# EAGLE design rld-node (EAGLE 9.6.2)

## Sheet 1 of 3
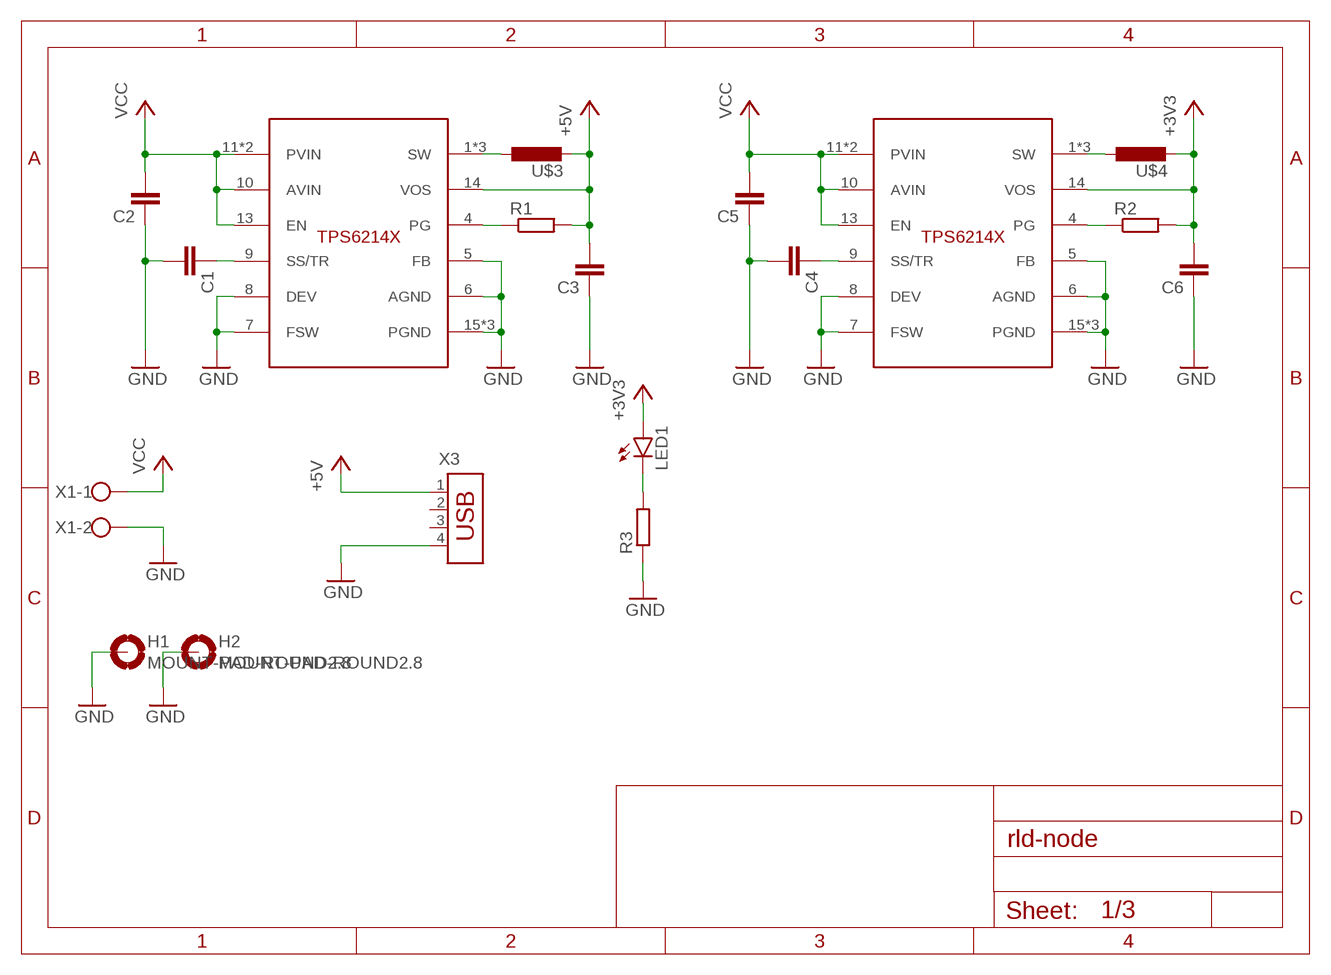
[diagram p0: schematic, sheet 1]

### Parts
C1  C-EUC0805  [C0805]
C2  C-EUC0805  [C0805]
C3  C-EUC0805  [C0805]
C4  C-EUC0805  [C0805]
C5  C-EUC0805  [C0805]
C6  C-EUC0805  [C0805]
H1  MOUNT-PAD-ROUND2.8  [2,8-PAD]
H2  MOUNT-PAD-ROUND2.8  [2,8-PAD]
L1  TPS6214X  [VQFN16-3X3]
L2  TPS6214X  [VQFN16-3X3]
LED1  LEDSML0805  [SML0805]
R1  R-EU_R0805  [R0805]
R2  R-EU_R0805  [R0805]
R3  R-EU_R0805  [R0805]
U$3  IHLP-1212  [1212BZ]
U$4  IHLP-1212  [1212BZ]
X1  W237-102  [W237-102]
X3  USB-787616  [USB]

### Nets
+3V3: C6.2 L2.14(VOS) LED1.A R2.2 U$4.2 ; also sheet 2,3
+5V: C3.2 L1.14(VOS) R1.2 U$3.2 X3.1
GND: C1.2 C2.1 C3.1 C4.2 C5.1 C6.1 H1.B2,8(MOUNT) H2.B2,8(MOUNT) L1.5(FB) L1.6(AGND) L1.7(FSW) L1.8(DEV) L1.15(PGND) L1.16(PGND) L1.17(PGND) L2.5(FB) L2.6(AGND) L2.7(FSW) L2.8(DEV) L2.15(PGND) L2.16(PGND) L2.17(PGND) R3.1 X1.2 X3.4 ; also sheet 2,3
N$1: C1.1 L1.9(SS/TR)
N$2: C4.1 L2.9(SS/TR)
N$3: L2.4(PG) R2.1
N$4: L1.4(PG) R1.1
N$5: L1.1(SW) L1.2(SW) L1.3(SW) U$3.1
N$6: L2.1(SW) L2.2(SW) L2.3(SW) U$4.1
N$7: LED1.C R3.2
VCC: C2.2 C5.2 L1.10(AVIN) L1.11(PVIN) L1.12(PVIN) L1.13(EN) L2.10(AVIN) L2.11(PVIN) L2.12(PVIN) L2.13(EN) X1.1
Unconnected: X3.2 X3.3

## Sheet 2 of 3
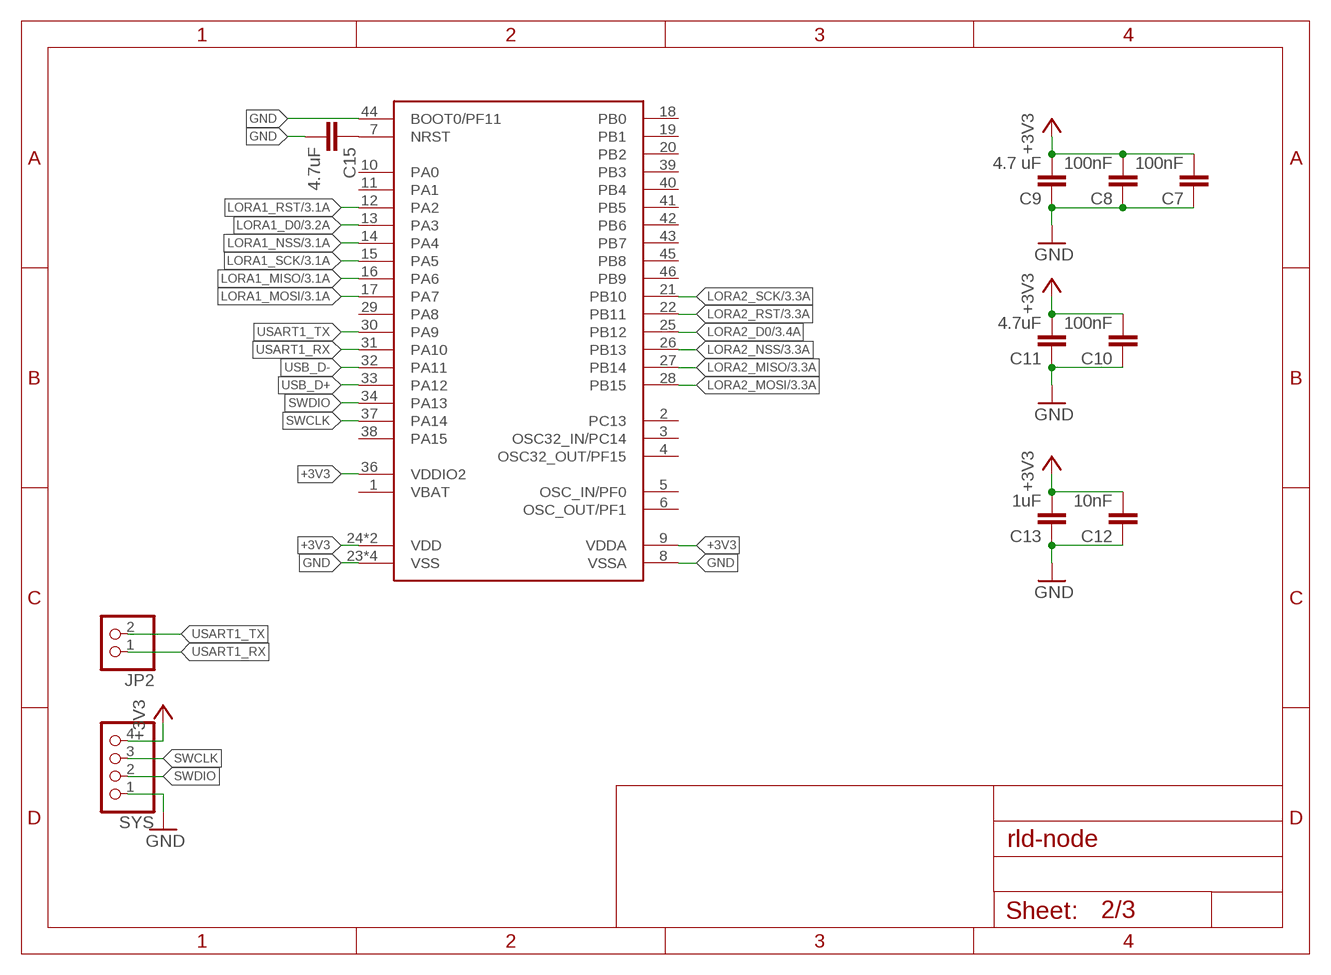
[diagram p1: schematic, sheet 2]

### Parts
C7  100nF  C-EUC0805  [C0805]
C8  100nF  C-EUC0805  [C0805]
C9  4.7 uF  C-EUC0805  [C0805]
C10  100nF  C-EUC0805  [C0805]
C11  4.7uF  C-EUC0805  [C0805]
C12  10nF  C-EUC0805  [C0805]
C13  1uF  C-EUC0805  [C0805]
C15  4.7uF  C-EUC0805  [C0805]
JP2  PINHD-1X2  [1X02]
SYS  PINHD-1X4  [1X04]
U$5  STM32-F042X4/6-48  [UFQFPN48-7X7]

### Nets
+3V3: C7.2 C8.2 C9.2 C10.2 C11.2 C12.2 C13.2 SYS.4 U$5.9(VDDA) U$5.24(VDD) U$5.36(VDDIO2) U$5.48(VDD) ; also sheet 1,3
GND: C7.1 C8.1 C9.1 C10.1 C11.1 C12.1 C13.1 C15.2 SYS.1 U$5.8(VSSA) U$5.23(VSS) U$5.35(VSS) U$5.44(BOOT0/PF11) U$5.47(VSS) U$5.49(VSS) ; also sheet 1,3
LORA1_D0: U$5.13(PA3) ; also sheet 3
LORA1_MISO: U$5.16(PA6) ; also sheet 3
LORA1_MOSI: U$5.17(PA7) ; also sheet 3
LORA1_NSS: U$5.14(PA4) ; also sheet 3
LORA1_RST: U$5.12(PA2) ; also sheet 3
LORA1_SCK: U$5.15(PA5) ; also sheet 3
LORA2_D0: U$5.25(PB12) ; also sheet 3
LORA2_MISO: U$5.27(PB14) ; also sheet 3
LORA2_MOSI: U$5.28(PB15) ; also sheet 3
LORA2_NSS: U$5.26(PB13) ; also sheet 3
LORA2_RST: U$5.22(PB11) ; also sheet 3
LORA2_SCK: U$5.21(PB10) ; also sheet 3
N$8: C15.1 U$5.7(NRST)
SWCLK: SYS.3 U$5.37(PA14)
SWDIO: SYS.2 U$5.34(PA13)
USART1_RX: JP2.1 U$5.31(PA10)
USART1_TX: JP2.2 U$5.30(PA9)
USB_D+: U$5.33(PA12)
USB_D-: U$5.32(PA11)
Unconnected: U$5.1(VBAT) U$5.2(PC13) U$5.3(OSC32_IN/PC14) U$5.4(OSC32_OUT/PF15) U$5.5(OSC_IN/PF0) U$5.6(OSC_OUT/PF1) U$5.10(PA0) U$5.11(PA1) U$5.18(PB0) U$5.19(PB1) U$5.20(PB2) U$5.29(PA8) U$5.38(PA15) U$5.39(PB3) U$5.40(PB4) U$5.41(PB5) U$5.42(PB6) U$5.43(PB7) U$5.45(PB8) U$5.46(PB9)

## Sheet 3 of 3
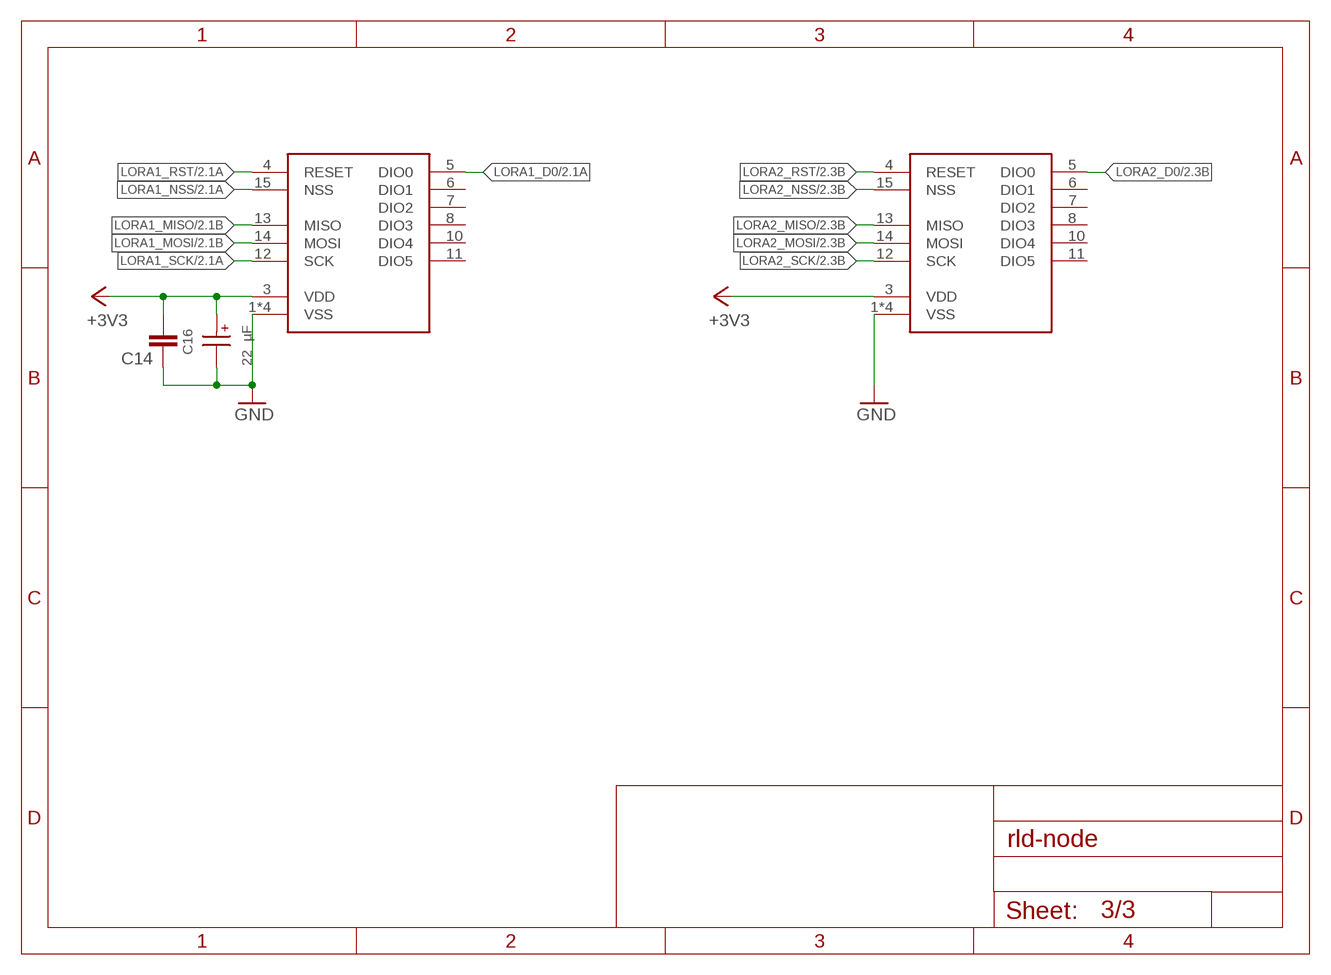
[diagram p2: schematic, sheet 3]

### Parts
C14  C-EUC0805  [C0805]
C16  22 µF  WCAP-ASLI_4X5.5_865080340003  [WCAP-ASLI_4X5.5(DXL)]
U$6  RA-02  [RA-01/RA-02]
U$7  RA-02  [RA-01/RA-02]

### Nets
+3V3: C14.2 C16.1(+) U$6.3(VDD) U$7.3(VDD) ; also sheet 1,2
GND: C14.1 C16.2(-) U$6.1(VSS) U$6.2(VSS) U$6.9(VSS) U$6.16(VSS) U$7.1(VSS) U$7.2(VSS) U$7.9(VSS) U$7.16(VSS) ; also sheet 1,2
LORA1_D0: U$6.5(DIO0) ; also sheet 2
LORA1_MISO: U$6.13(MISO) ; also sheet 2
LORA1_MOSI: U$6.14(MOSI) ; also sheet 2
LORA1_NSS: U$6.15(NSS) ; also sheet 2
LORA1_RST: U$6.4(RESET) ; also sheet 2
LORA1_SCK: U$6.12(SCK) ; also sheet 2
LORA2_D0: U$7.5(DIO0) ; also sheet 2
LORA2_MISO: U$7.13(MISO) ; also sheet 2
LORA2_MOSI: U$7.14(MOSI) ; also sheet 2
LORA2_NSS: U$7.15(NSS) ; also sheet 2
LORA2_RST: U$7.4(RESET) ; also sheet 2
LORA2_SCK: U$7.12(SCK) ; also sheet 2
Unconnected: U$6.6(DIO1) U$6.7(DIO2) U$6.8(DIO3) U$6.10(DIO4) U$6.11(DIO5) U$7.6(DIO1) U$7.7(DIO2) U$7.8(DIO3) U$7.10(DIO4) U$7.11(DIO5)

## Library data of the parts
C1-C15 = rcl:C-EU: CAPACITOR, European symbol; SPICEPREFIX: C
C16 = Eagle_WCAP-ASLI_rev20a:WCAP-ASLI_4X5.5: WCAP-ASLI Aluminium Electrolytic Capacitors Low Impedance +105 °C Characteristics Low impedance product series Mounting style: V-Chip SMT Capacitance range: 0.1 µF ‒ 6800 µF Capacitance tolerance: ±20 % Voltage range (UR): 6.3 ‒ 100 V(DC) Operating temperature: -55 °C up to +105 °C Endurance: 2000 h @ +105 °C Dimensions (DxL) in mm: 4.0 x 5.5 up to 16.0 x 17.0 Recommended soldering: Reflow soldering Applications Low impedance, especially for filtering applications Input and output capacitor for switched-mode power supply Filtering Smoothing e.g. DC/DC converter, AC/DC converter, satellite receiver, control panel <https://www.we-online.com/catalog/media/o14723v209%20Family_WCAP-ASLI.jpg> Details see: https://www.we-online.com/catalog/en/WCAP-ASLI/ Updated by yingchun,Shan;2020-03-02 2020(C) Würth Elektronik; DATASHEET-URL: https://www.we-online.com/catalog/datasheet/865080340003.pdf; DF: 16%; DIAMETER: 4mm; I-LEAK: 3.52uA; I-RIPPLE: 90mA; L: 5.5mm; OPERATING-TEMPERATURE: -55 °C up to +105 °C; PART-NUMBER: 865080340003; TECHNICAL-REFERENCE: ASEB055220M016DVCTAB000; VR: 16V(DC)
H1 H2 = holes:MOUNT-PAD-ROUND: MOUNTING PAD, round
JP2 = pinhead:PINHD-1X2: PIN HEADER
L1 L2 = texas-instruments:TPS6214X
LED1 = led:LED: LED OSRAM: - CHIPLED LG R971, LG N971, LY N971, LG Q971, LY Q971, LO R971, LY R971 LH N974, LH R974 LS Q976, LO Q976, LY Q976 LO Q996 - Hyper CHIPLED LW Q18S LB Q993, LB Q99A, LB R99A - SideLED LS A670, LO A670, LY A670, LG A670, LP A670 LB A673, LV A673, LT A673, LW A673 LH A674 LY A675 LS A676, LA A676, LO A676, LY A676, LW A676 LS A679, LY A679, LG A679 - Hyper Micro SIDELED® LS Y876, LA Y876, LO Y876, LY Y876 LT Y87S - SmartLED LW L88C, LW L88S LB L89C, LB L89S, LG L890 LS L89K, LO L89K, LY L89K LS L896, LA L896, LO L896, LY L896 - TOPLED LS T670, LO T670, LY T670, LG T670, LP T670 LSG T670, LSP T670, LSY T670, LOP T670, LYG T670 LG T671, LOG T671, LSG T671 LB T673, LV T673, LT T673, LW T673 LH T674 LS T676, LA T676, LO T676, LY T676, LB T676, LH T676, LSB T676, LW T676 LB T67C, LV T67C, LT T67C, LS T67K, LO T67K, LY T67K, LW E67C LS E67B, LA E67B, LO E67B, LY E67B, LB E67C, LV E67C, LT E67C LW T67C LS T679, LY T679, LG T679 LS T770, LO T770, LY T770, LG T770, LP T770 LB T773, LV T773, LT T773, LW T773 LH T774 LS E675, LA E675, LY E675, LS T675 LS T776, LA T776, LO T776, LY T776, LB T776 LHGB T686 LT T68C, LB T68C - Hyper Mini TOPLED® LB M676 - Mini TOPLED Santana® LG M470 LS M47K, LO M47K, LY M47K Source: http://www.osram.convergy.de LUXEON: - LUMILED® LXK2-PW12-R00, LXK2-PW12-S00, LXK2-PW14-U00, LXK2-PW14-V00 LXK2-PM12-R00, LXK2-PM12-S00, LXK2-PM14-U00 LXK2-PE12-Q00, LXK2-PE12-R00, LXK2-PE12-S00, LXK2-PE14-T00, LXK2-PE14-U00 LXK2-PB12-K00, LXK2-PB12-L00, LXK2-PB12-M00, LXK2-PB14-N00, LXK2-PB14-P00, LXK2-PB14-Q00 LXK2-PR12-L00, LXK2-PR12-M00, LXK2-PR14-Q00, LXK2-PR14-R00 LXK2-PD12-Q00, LXK2-PD12-R00, LXK2-PD12-S00 LXK2-PH12-R00, LXK2-PH12-S00 LXK2-PL12-P00, LXK2-PL12-Q00, LXK2-PL12-R00 Source: www.luxeon.com KINGBRIGHT: KA-3528ASYC Source: www.kingbright.com
R1-R3 = rcl:R-EU_: RESISTOR, European symbol; SPICEPREFIX: R
SYS = pinhead:PINHD-1X4: PIN HEADER
U$3 U$4 = inductor-vishay:IHLP-1212
U$5 = st-microelectronics:STM32-F042X4/6-48
U$6 U$7 = ai-thinker:RA-02
X1 = con-wago-500:W237-102: WAGO SCREW CLAMP; MPN: 237-102; OC_FARNELL: unknown; OC_NEWARK: 70K9898
X3 = con-amp:USB-787616: AMP connector

## Board
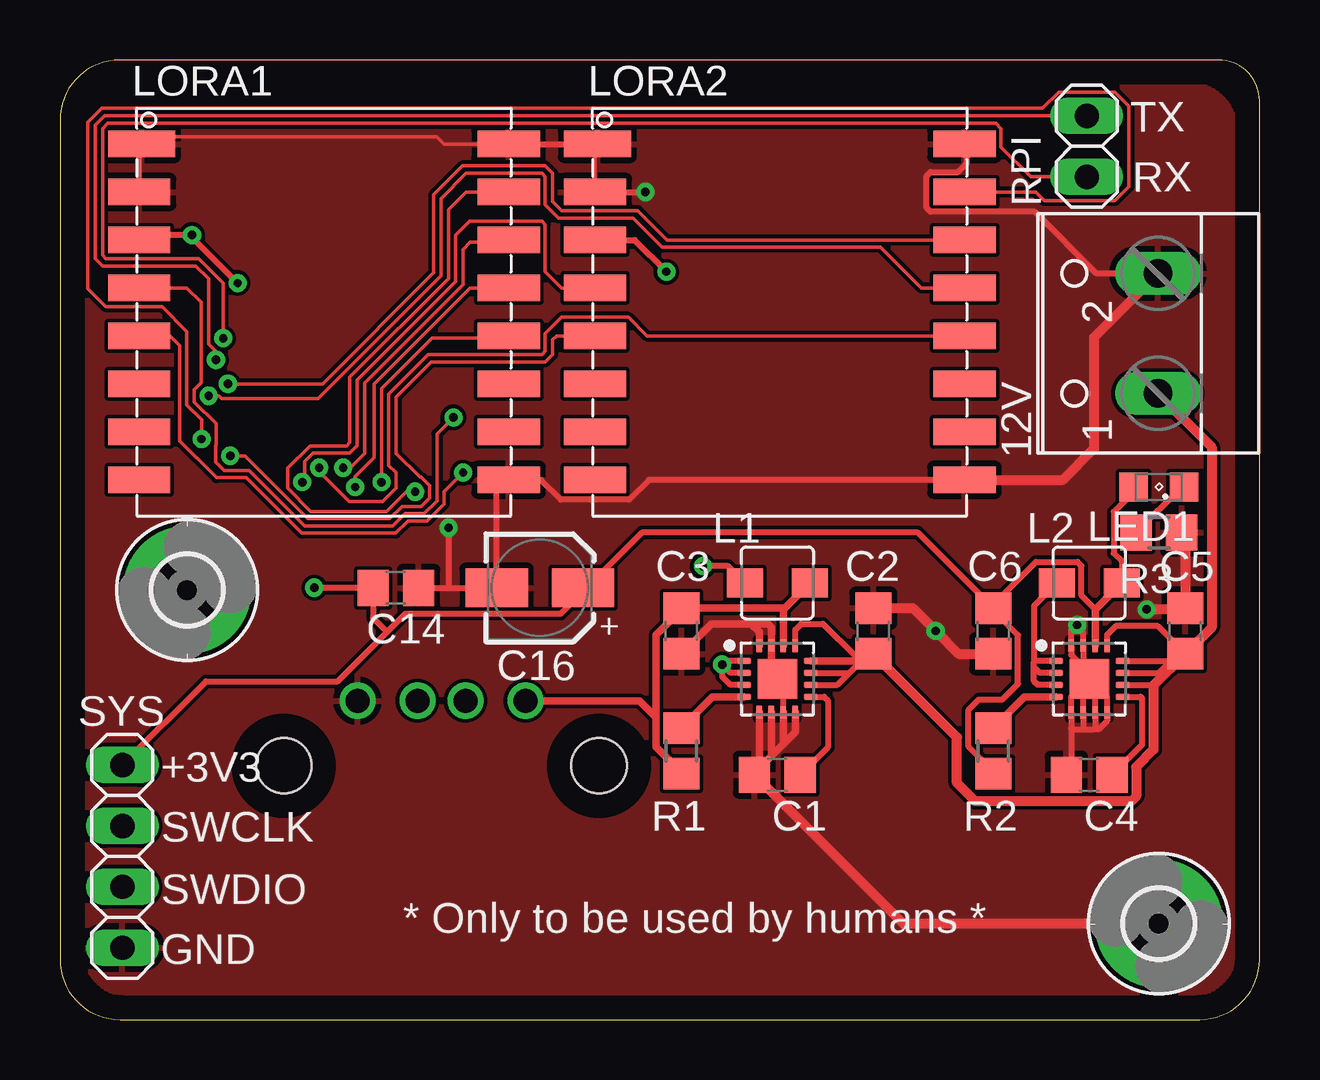
[diagram p3: board, top side]
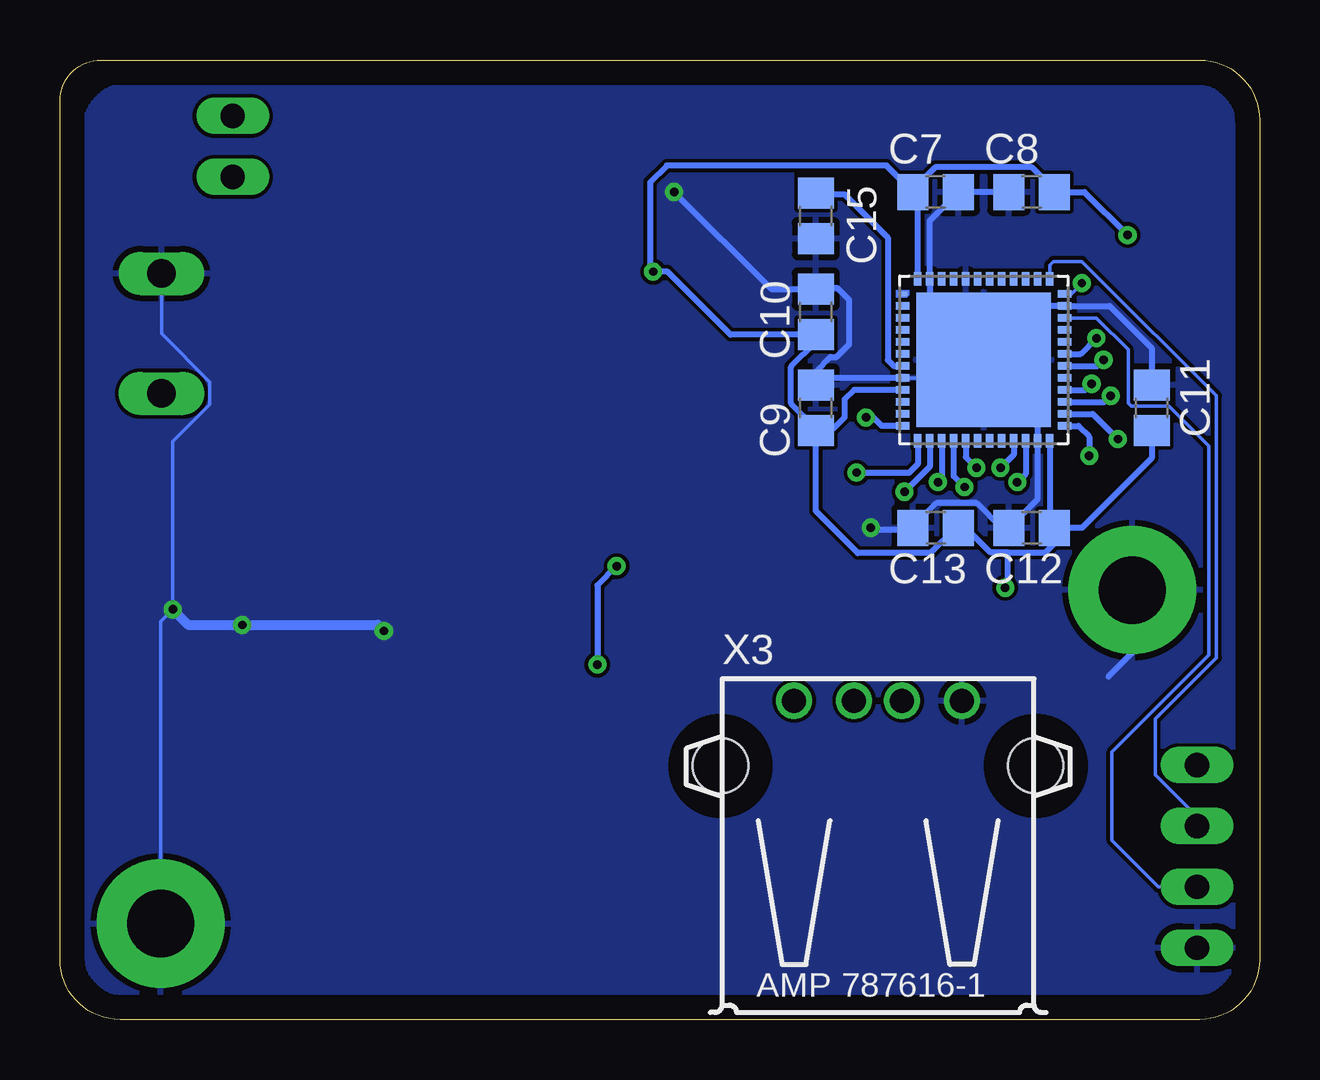
[diagram p4: board, bottom side, seen from below]

Size 50 x 40 mm. Coordinates in mm from the lower left corner, seen from the top.
Outline: 50,2.5 50,38.29 arc90 48.29,40 2.5,40 arc90 0,37.5 0,2.5 arc90 2.5,0 47.5,0 arc90 50,2.5
Copper layers (1*16): Top 0.035mm / dielectric 1.5mm / Bottom 0.035mm
Design rules "default *": minimum track width 6mil, minimum drill 0.3mm, track to track 6mil, track to pad 6mil, pad to pad 6mil, via to via 6mil, smd to smd 6mil, copper to edge 40mil, drill to drill 6mil, minimum pad ring 10mil, minimum via ring 8mil, stop-mask expansion 4mil, vias tented up to drill 0mil, thermal gap 10mil

### Footprints (pad centres in the part's own frame; a part is rotated, then mirrored left to right if it is on the bottom)
C0805 = smd 1.3 x 1.5: 1 -0.95,0; 2 0.95,0
WCAP-ASLI_4X5.5(DXL) = smd 2.6 x 1.6: 1 1.8,0; 2 -1.8,0
2,8-PAD = drill 2.8 pad 5.334: B2,8 0,0
1X02 = drill 1.016 long: 1 -1.27,0; 2 1.27,0
VQFN16-3X3 = smd 0.5 x 0.24: 1 -1.4,0.75; 2 -1.4,0.25; 3 -1.4,-0.25; 4 -1.4,-0.75; 9 1.4,-0.75; 10 1.4,-0.25; 11 1.4,0.25; 12 1.4,0.75 | smd 0.24 x 0.5: 5 -0.75,-1.4; 6 -0.25,-1.4; 7 0.25,-1.4; 8 0.75,-1.4; 13 0.75,1.4; 14 0.25,1.4; 15 -0.25,1.4; 16 -0.75,1.4 | smd 1.58 x 1.58: 17 0,0
SML0805 = smd 1.2 x 1.2: A 1.05,0; C -1.05,0
R0805 = smd 1.3 x 1.5: 1 -0.95,0; 2 0.95,0
1X04 = drill 1.016 long: 1 -3.81,0; 2 -1.27,0; 3 1.27,0; 4 3.81,0
1212BZ = smd 1.5 x 1.2: 1 -1.35,0; 2 1.35,0
UFQFPN48-7X7 = smd 0.4 x 0.2: 1 -3.375,2.75 | smd 0.55 x 0.3: 2 -3.375,2.25; 3 -3.375,1.75; 4 -3.375,1.25; 5 -3.375,0.75; 6 -3.375,0.25; 7 -3.375,-0.25; 8 -3.375,-0.75; 9 -3.375,-1.25; 10 -3.375,-1.75; 11 -3.375,-2.25; 12 -3.375,-2.75; 25 3.375,-2.75; 26 3.375,-2.25; 27 3.375,-1.75; 28 3.375,-1.25; 29 3.375,-0.75; 30 3.375,-0.25; 31 3.375,0.25; 32 3.375,0.75; 33 3.375,1.25; 34 3.375,1.75; 35 3.375,2.25; 36 3.375,2.75 | smd 0.3 x 0.55: 13 -2.75,-3.375; 14 -2.25,-3.375; 15 -1.75,-3.375; 16 -1.25,-3.375; 17 -0.75,-3.375; 18 -0.25,-3.375; 19 0.25,-3.375; 20 0.75,-3.375; 21 1.25,-3.375; 22 1.75,-3.375; 23 2.25,-3.375; 24 2.75,-3.375; 37 2.75,3.375; 38 2.25,3.375; 39 1.75,3.375; 40 1.25,3.375; 41 0.75,3.375; 42 0.25,3.375; 43 -0.25,3.375; 44 -0.75,3.375; 45 -1.25,3.375; 46 -1.75,3.375; 47 -2.25,3.375; 48 -2.75,3.375 | smd 5.6 x 5.6: 49 0,0
RA-01/RA-02 = smd 2.8 x 1.1: 1 -7.6,7 | smd 2.6 x 1.1: 2 -7.7,5; 3 -7.7,3; 4 -7.7,1; 5 -7.7,-1; 6 -7.7,-3; 7 -7.7,-5; 8 -7.7,-7; 9 7.7,-7; 10 7.7,-5; 11 7.7,-3; 12 7.7,-1; 13 7.7,1; 14 7.7,3; 15 7.7,5; 16 7.7,7
W237-102 = drill 1.194 long: 1 -2.5,-1.27; 2 2.5,-1.27
USB = drill 1: 1 -3.5,12.99; 2 -1,12.99; 3 1,12.99; 4 3.5,12.99 | hole 2.3: -6.57,10.28; 6.57,10.28

### Placement (x,y rotation side)
C1  29.9,10.2 180 top
C2  33.9,16.2 270 top
C3  25.9,16.2 90 top
C4  42.9,10.2 180 top
C5  46.9,16.2 270 top
C6  38.9,16.2 90 top
C7  13.5,34.5 180 bottom
C8  9.5,34.5 0 bottom
C9  18.5,25.5 270 bottom
C10  18.5,29.5 270 bottom
C11  4.5,25.5 270 bottom
C12  9.5,20.5 0 bottom
C13  13.5,20.5 0 bottom
C14  14,18 180 top
C15  18.5,33.5 270 bottom
C16  20,18 0 top
H1  45.8,4 90 top
H2  5.3,17.9 0 top
JP2  42.8,36.4 90 top
L1  29.9,14.2 0 top
L2  42.9,14.2 0 top
LED1  45.8,22.2 180 top
R1  25.9,11.2 270 top
R2  38.9,11.2 270 top
R3  45.8,20.3 180 top
SYS  2.6,6.8 90 top
U$3  29.9,18.2 0 top
U$4  42.9,18.2 0 top
U$5  11.5,27.5 0 bottom
U$6  11,29.5 0 top
U$7  30,29.5 0 top
X1  44.5,28.6 90 top
X3  15.9,0.3 0 bottom

### Tracks (layer width: path | path; a pad name or v marks a point on that pad's centre or on a via)
+3V3  (via drill 0.35)
  Top 0.152: 21.99,18.04 C16.1 | 5.41,32.7 5.4,32.7
  Top 0.254: R2.2 38.9,10.36 37.87,11.38 37.87,12.92 38.3,13.34 39.27,13.34 39.93,14 39.93,16.02 38.9,17.05 C6.2 | U$6.3 3.5,32.7 5.4,32.7 v5.5,32.7 | U$7.3 23.95,32.5 v25.27,31.18 | 43.15,17.1 42.58,17.67 42.58,18.92 42.42,19.08 40.68,19.08 38.9,17.3 C6.2 | C6.2 35.75,20.3 24.26,20.3 21.99,18.04 20.88,16.92 14.4,16.92 13.64,16.16 | v10.6,18 C14.2 13.05,16.75 13.64,16.16 | v7.41,30.7 5.41,32.7 | SYS.4 6.09,14.1 11.58,14.1 13.64,16.16 | 44.75,18.7 U$4.2 44.25,19.11 43.92,19.43 43.92,21.17 44.75,22 LED1.A
  Top 0.305: U$4.2 43.15,17.1 L2.14
  Bottom 0.152: U$5.36 7.85,30.25 v7.4,30.7 v7.41,30.7
  Bottom 0.254: U$5.24 8.75,20.7 C12.2 | U$5.9 16.91,26.25 17.3,25.86 17.3,25.1 17.75,24.66 18.5,24.66 | U$5.48 14.25,34.3 C7.2 | C7.2 14.45,34.6 13.52,35.53 9.48,35.53 8.55,34.59 C8.2 7.3,34.5 v5.5,32.7 | C7.2 15.55,35.6 24.7,35.6 25.4,34.9 25.4,31.3 v25.27,31.18 24.68,31.18 22.05,28.55 C10.2 18.5,28.25 19.53,27.22 19.53,25.68 18.5,24.66 | 18.5,24.66 C9.2 18.5,21.2 16.74,19.44 13.71,19.44 12.65,20.5 C13.2 12.24,20.5 11.22,19.47 10.5,19.47 | v10.6,18 10.5,18.1 10.5,19.47 | C12.2 7.4,20.5 4.5,23.4 C11.2 | C12.2 8.55,19.85 8.93,19.47 10.5,19.47
+5V
  Top 0.305: L1.14 30.15,17.1 | 30.15,17.1 U$3.2 | 30.15,17.1 30.1,17.15 C3.2 25.9,17.08 24.84,16.03 24.84,12.6 | R1.2 25.9,10.32 24.84,11.37 24.84,12.6 | X3.1 24.16,13.29 24.84,12.6
GND  (via drill 0.35)
  Top 0.152: 42.8,14.25 L2.17 | C5.1 46.8,17.12 | U$6.16 16,36.5 15.7,36.8 3.7,36.8 | U$7.16 37.65,36.45 37.8,36.3 | U$7.2 22.3,36.4 U$7.1
  Top 0.254: L1.7 30.15,13.95 L1.17 | U$6.16 U$7.1 | 3.7,36.8 U$6.1 3.3,36.4 U$6.2 | 42.3,16.4 42.4,16.4 42.65,16.15 L2.15 42.65,14.7 | v42.4,16.45 42.35,16.45 42.3,16.4 | 42.3,16.4 42.15,16.25 L2.16 42.15,15.2 42.65,14.7 | 42.65,14.7 42.65,14.4 42.8,14.25 | 42.6,13.9 42.15,13.45 L2.5 42.15,12.15 | 42.6,13.9 L2.17 43.15,13.95 | 42.6,13.9 42.65,13.85 L2.6 42.65,12.15 42.7,12.1 | 43.15,13.95 L2.7 43.15,12.15 43.1,12.1 | 43.15,13.95 43.65,13.45 L2.8 43.65,12.45 43.3,12.1 43.1,12.1 | 42.15,12.15 42.2,12.1 42.7,12.1 | 42.7,12.1 43.1,12.1 | 42.15,12.15 42.15,10.4 C4.2 | X1.2 43.2,31.1 40.63,33.67 36.28,33.67 36.12,33.83 36.12,35.17 36.28,35.33 37.43,35.33 37.8,35.7 37.8,36.3 | 16.2,18 C14.1 14.85,18 | 16.2,18 C16.2 18.2,22 U$6.9 20.05,22.5 20.88,21.67 23.72,21.67 24.55,22.5 U$7.9 | v16.2,20.5 16.2,18 | U$7.2 v24.4,34.5 | 6.43,19.03 H2.B2,8
  Top 0.305: C1.2 29.15,10.4 29.15,10.5 | L1.5 29.15,10.5 | L1.6 29.65,11 | 29.65,11 29.15,10.5 | L1.7 30.15,11.5 | 30.15,11.5 29.65,11 | L1.8 30.65,12 30.15,11.5 | L1.17 29.65,14.45 L1.15 29.65,16.35 29.5,16.5 28.8,16.5 | L1.16 29.15,16.15 28.8,16.5 | C3.1 27.15,16.5 28.8,16.5
  Top 0.406: X1.2 43.1,28.43 43.1,23.8 41.8,22.5 U$7.9 | 46.8,17.12 46.77,17.1 v45.3,17.1 | C2.1 35.55,17.15 v36.5,16.2 37.45,15.25 C6.1 | 46.9,20 C5.1 | C1.2 29.84,9.31 29.84,9.3 35.15,4 H1.B2,8
  Bottom 0.152: 14.5,20.5 C13.1 | 9.5,29.75 13.62,29.75 U$5.49 | X1.2 45.77,28.59 43.75,26.57 43.75,25.63 45.3,24.09 v45.3,17.1 45.8,16.6 H1.B2,8 | U$5.8 13.75,26.75 | 12.61,27.89 11.89,27.89 11.35,27.35
  Bottom 0.254: C11.1 4.5,28 6.25,29.75 U$5.35 9.5,29.75 | U$5.8 18.2,26.75 C9.1 18.5,27 17.88,27.62 17.63,27.62 17.1,28.16 17.1,30 17.6,30.5 18.45,30.5 C10.1 20.35,30.45 v24.4,34.5 | C8.1 C7.1 13.75,33.3 U$5.47 13.75,29.75 U$5.49 11.35,27.35 9.25,25.25 U$5.23 9.25,21.7 C12.1 10.76,20.5 11.78,21.53 13.47,21.53 14.5,20.5 14.6,20.4 16.1,20.4 v16.2,20.5 | 13.75,26.75 12.61,27.89 | 6.3,14.3 5.3,15.3 H2.B2,8
  Bottom 0.406: v45.3,17.1 44.65,16.45 v42.4,16.45 36.75,16.45 v36.5,16.2
  pour Bottom: 1,34 1,37 arc-90 3,39 47,39 arc-90 49,37 49,3 arc-90 47,1 3,1 arc-90 1,3
  pour Top: 1,37 arc-90 3,39 5,39 47,39 arc-90 49,37 49,3 arc-90 47,1 3,1 arc-90 1,3
LORA1_D0  (via drill 0.35)
  Top 0.152: U$6.5 4.58,28.5 4.98,28.1 4.98,24.12 5.7,23.4 5.71,23.4 6.52,22.59 7.76,22.59 10.08,20.27 14,20.27 14.51,20.78 15.3,20.78 16.02,21.5 16.02,22.02 v16.8,22.8
  Bottom 0.254: v16.8,22.8 14.6,22.8 14.25,23.15 U$5.13
LORA1_MISO  (via drill 0.35)
  Top 0.152: U$6.13 17.1,30.5 13.1,26.5 13.1,23.44 12.3,22.64 v12.3,22.2
  Bottom 0.254: U$5.16 12.75,22.65 v12.3,22.2
LORA1_MOSI  (via drill 0.35)
  Top 0.152: v11.8,23 12.09,23 12.69,23.6 12.69,26.52 16.8,30.63 16.8,32.1 17.1,32.4 18.6,32.4 U$6.14
  Bottom 0.254: U$5.17 12.25,23.45 v11.8,23
LORA1_NSS  (via drill 0.35)
  Top 0.152: U$6.15 16.93,34.5 16.19,33.76 16.19,30.88 12.08,26.77 12.08,24.05 11.94,23.91 10.42,23.91 9.49,22.98 9.49,22.15 10.46,21.19 13.62,21.19 14.43,22 v14.8,22
  Bottom 0.254: U$5.14 13.75,23.05 v14.8,22
LORA1_RST  (via drill 0.35)
  Top 0.152: v16.4,25.1 15.71,24.41 15.71,21.62 15.18,21.09 14.38,21.09 13.87,20.58 10.2,20.58 7.89,22.89 6.85,22.89 6.49,23.25 6.49,23.93 6.51,23.95 6.51,24.84 5.59,25.75 5.59,26.25 5.89,26.55 5.89,29.9 5.29,30.5 U$6.4
  Bottom 0.254: U$5.12 15.75,24.75 16.1,25.1 v16.4,25.1
LORA1_SCK  (via drill 0.35)
  Top 0.152: v13.4,22.4 13.4,26.3 15.5,28.4 18.6,28.4 U$6.12
  Bottom 0.254: U$5.15 13.25,22.55 v13.4,22.4
LORA2_D0  (via drill 0.35)
  Top 0.152: U$7.5 20.7,28.5 20.53,28.33 20.53,27.73 20.22,27.42 15.47,27.42 14.01,25.95 14.01,23.6 15,22.61 15.05,22.61 15.41,22.25 15.41,21.75 15.05,21.39 14.26,21.39 13.75,20.88 10.33,20.88 7.71,23.5 v7.1,23.5
  Bottom 0.254: U$5.25 7.55,24.75 7.1,24.3 v7.1,23.5
LORA2_MISO  (via drill 0.35)
  Top 0.152: v6.2,26 6.64,26 6.75,25.89 10.77,25.89 15.89,31.01 15.89,34.23 16.94,35.28 20.09,35.28 20.23,35.15 20.23,33.97 20.78,33.42 23.88,33.42 25.1,32.2 34.2,32.2 35.9,30.5 U$7.13
  Bottom 0.254: U$5.27 6.45,25.75 v6.2,26
LORA2_MOSI  (via drill 0.35)
  Top 0.152: v7,26.5 10.95,26.5 15.58,31.14 15.58,34.38 16.78,35.58 20.22,35.58 20.53,35.27 20.53,34.09 20.91,33.72 24.08,33.72 25.3,32.5 U$7.14
  Bottom 0.254: U$5.28 7.25,26.25 v7,26.5
LORA2_NSS  (via drill 0.35)
  Top 0.152: v5.9,24.2 5.9,25.01 5.29,25.62 5.29,28.68 4.25,29.72 1.91,29.72 1.16,30.46 1.16,37.4 1.74,37.98 40.95,37.98 41.63,38.66 43.97,38.66 44.55,38.08 44.55,34.72 43.97,34.14 41.03,34.14 40.67,34.5 U$7.15
  Bottom 0.254: U$5.26 6.95,25.25 v5.9,24.2
LORA2_RST  (via drill 0.35)
  Top 0.152: v10.1,22.4 10.19,22.49 10.19,23.25 10.55,23.61 12.07,23.61 12.39,23.93 12.39,26.65 16.5,30.76 16.5,32.7 17.08,33.28 20.09,33.28 20.23,33.15 20.23,31.17 20.9,30.5 U$7.4
  Bottom 0.254: U$5.22 9.75,22.75 v10.1,22.4
LORA2_SCK  (via drill 0.35)
  Top 0.152: v10.8,23 10.8,22.84 12.05,21.59 13.45,21.59 14.01,22.15 14.01,22.79 13.71,23.09 13.71,26.08 15.35,27.72 20.09,27.72 20.23,27.86 20.23,28.6 20.91,29.28 23.7,29.28 24.47,28.5 U$7.12
  Bottom 0.254: U$5.21 10.25,23.55 v10.8,23
N$1
  Top 0.254: L1.9 31.85,13.45 32,13.3 32,11.35 C1.1
N$2
  Top 0.254: L2.9 45.05,13.45 45.1,13.4 45.1,11.45 C4.1
N$3
  Top 0.305: L2.4 40.2,13.45 R2.1
N$4
  Top 0.305: R1.1 27.2,13.45 L1.4
N$5  (via drill 0.35)
  Top 0.254: L1.3 27.95,13.95 27.6,14.3 v27.6,14.8 | L1.2 27.95,14.45 v27.6,14.8 | v27.6,14.8 27.75,14.95 L1.1 | U$3.1 27.85,18.9 v26.8,18.9
  Bottom 0.254: v26.8,18.9 27.6,18.1 v27.6,14.8
N$6
  Top 0.254: U$4.1 40.6,17.25 40.6,14.9 | 40.6,14.7 40.6,14.9 | L2.1 40.65,14.95 40.6,14.9 | L2.2 40.85,14.45 40.6,14.7 | L2.3 40.75,13.95 40.6,14.1 40.6,14.7
N$7
  Top 0.254: R3.2 46.75,22.2 LED1.C
N$8
  Bottom 0.254: U$5.7 15.25,27.25 15.5,27.5 15.5,32.6 17.3,34.4 18.45,34.4 C15.1
SWCLK
  Bottom 0.152: U$5.37 8.75,31.45 8.6,31.6 8.2,31.6 7.4,31.6 6.9,31.1 1.8,26 1.8,15.07 4.35,12.52 4.35,10.2 2.6,8.45 SYS.3
SWDIO
  Bottom 0.152: U$5.34 6.79,29.25 5.48,27.94 5.48,25.7 5.34,25.57 3.77,25.57 2.1,23.9 2.1,15.2 6.15,11.15 6.15,7.46 4.22,5.53 SYS.2
USART1_RX  (via drill 0.35)
  Top 0.152: v6.8,28.4 6.8,30.7 5.78,31.72 1.91,31.72 1.77,31.86 1.77,37.15 2,37.37 39,37.37 39.23,37.15 39.23,36.37 40.47,35.13 JP2.1
  Bottom 0.254: U$5.31 7.45,27.75 v6.8,28.4
USART1_TX  (via drill 0.35)
  Top 0.152: v6.5,27.5 6.5,27.84 6.19,28.15 6.19,30.88 5.65,31.42 1.78,31.42 1.47,31.73 1.47,37.27 1.87,37.67 JP2.2
  Bottom 0.254: U$5.30 6.75,27.25 v6.5,27.5
VCC
  Top 0.254: L1.11 32.9,14.45 | 32.9,14.45 33.4,14.95 | L1.10 32.4,13.95 32.9,14.45 | L1.13 30.65,16.25 30.9,16.5 31.8,16.5 33.12,15.18 33.98,15.18 C2.2 | 46.73,14.9 46.73,15.07 | L2.11 45.8,14.45 46.12,14.78 | 46.12,14.78 46.3,14.95 L2.12 | L2.10 45.6,13.95 46.12,14.47 46.12,14.78 | L2.13 43.65,16.05 44,16.4 45.75,16.4 C5.2
  Top 0.305: L1.12 33.4,14.95 33.6,14.95 C2.2 | C5.2 46.73,15.07 46.6,14.95 46.3,14.95
  Top 0.406: 46.73,14.9 46.73,15.07 48.01,16.35 48.01,23.86 X1.1 | C5.2 45.58,13.93 45.58,11.25 44.86,10.52 44.86,9.3 44.65,9.09 38.15,9.09 37.39,9.86 37.39,11.76 C2.2

### Text on the board
tNames: LORA1 | LORA2 | TX | RPI | RX | 12V | C16 | +3V3 | SWCLK | SWDIO | * Only to be used by humans * | GND